# Altium schematic sheet SUPPLY.SchDoc
size A4
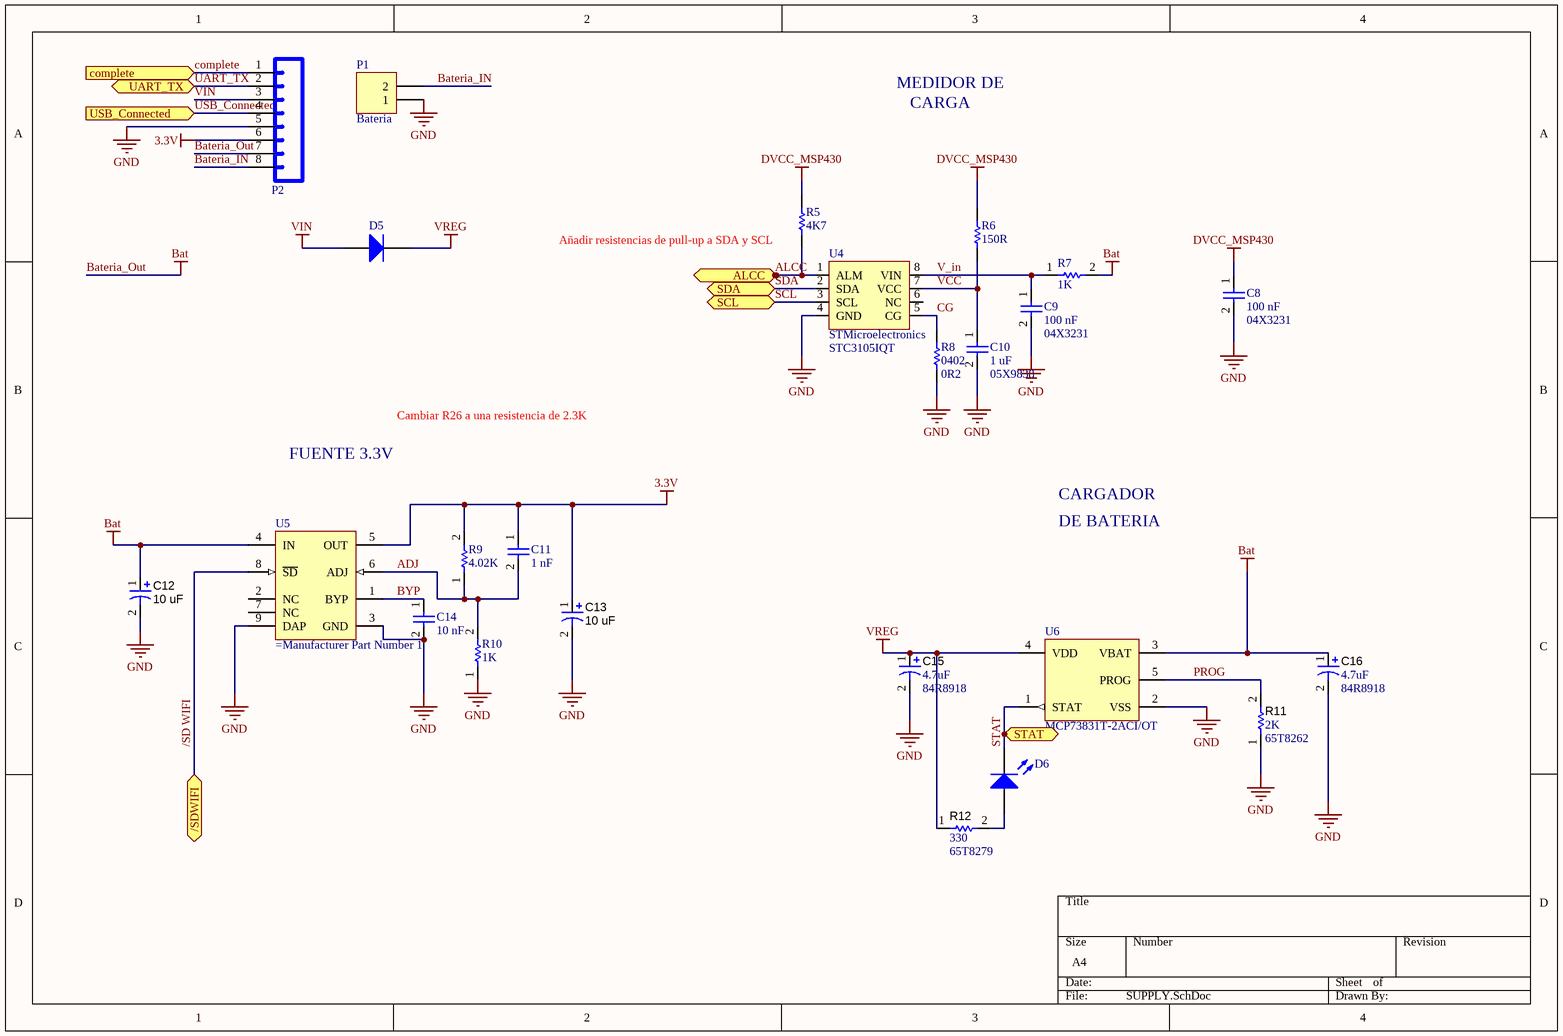
[diagram p0: SUPPLY.SchDoc]

## Parts
C8  100 nF  Supplier Part Number 1: 04X3231  [CR-0402]
C9  100 nF  Supplier Part Number 1: 04X3231  [CR-0402]
C10  1 uF  Supplier Part Number 1: 05X9838  [CR-0402]
C11  1 nF  [CR-0402]
C12  10 uF  [C-0603]
C13  10 uF  [C-0603]
C14  10 nF  [CR-0402]
C15  Supplier Part Number 1: 84R8918  [C-0603]  (hidden comment: 4.7uF)
C16  Supplier Part Number 1: 84R8918  [C-0603]  (hidden comment: 4.7uF)
D5  58K2394  [DO-214AA d]  (value not drawn)
D6  LED0  [CR-0402]  (value not drawn)
P1  Bateria  [HDR1X2]
P2  68000-236HLF  [HEAD8-NOSS]  (value not drawn)
R5  4K7  [CR-0402]
R6  150R  [CR-0402]
R7  1K  [CR-0402]
R8  0402  value 0R2  [R-0402]
R9  4.02K  [CR-0402]
R10  1K  [CR-0402]
R11  Supplier Part Number 1: 65T8262  [CR-0402]  (hidden comment: 2K)
R12  Supplier Part Number 1: 65T8279  [R-0402]  (hidden comment: 330)
U4  STMicroelectronics  Manufacturer Part Number 1: STC3105IQT  [TDFN8]
U5  (no value)  [SO8 DDA]
U6  MCP73831T-2ACI/OT  [SOT-23-5_3d]

## Ports
/SDWIFI (bidir), ALCC (bidir), complete (in), SCL (bidir), SDA (bidir), STAT (out), UART_TX (bidir), USB_Connected (in)

## Nets
3.3V: C11.1 C13.1(+) P2.6 R9.2 U5.5(OUT)
Bateria_Out: C12.1(+) C16.1(+) P2.7 R7.2 U5.4(IN) U6.3(VBAT)  [also labelled Bat]
DVCC_MSP430: C8.1 R5.2 R6.2
GND: C8.2 C9.2 C10.2 C12.2(-) C13.2(-) C14.2 C15.2(-) C16.2(-) P1.1 P2.5 R8.1 R10.1 R11.1 U4.4(GND) U5.3(GND) U5.9(DAP) U6.2(VSS)
VIN: D5.1(A) P2.3
VREG: C15.1(+) D5.2(K) R12.1 U6.4(VDD)
/SD WIFI: U5.8(~{SD}) ; port /SDWIFI
ADJ: C11.2 R9.1 R10.2 U5.6(ADJ)
ALCC: R5.1 U4.1(ALM) ; port ALCC
Bateria_IN: P1.2 P2.8
BYP: C14.1 U5.1(BYP)
CG: R8.2 U4.5(CG)
complete: P2.1 ; port complete
PROG: R11.2 U6.5(PROG)
SCL: U4.3(SCL) ; port SCL
SDA: U4.2(SDA) ; port SDA
STAT: D6.2(K) U6.1(STAT) ; port STAT
UART_TX: P2.2 ; port UART_TX
USB_Connected: P2.4 ; port USB_Connected
V_in: C9.1 R7.1 U4.8(VIN)
VCC: C10.1 R6.1 U4.7(VCC)
NetD6_1: D6.1(A) R12.2

Not connected (* = marked no-connect by the designer): U4 6(NC); U5 2(NC) 7(NC)

## Notes on the sheet
- MEDIDOR DE
- CARGA
- (near R5) Añadir resistencias de pull-up a SDA y SCL
- Cambiar R26 a una resistencia de 2.3K
- FUENTE 3.3V
- CARGADOR
- DE BATERIA

## Library data of the parts
C8 C9 = C1005X7R1H104M050BB: TDK - C1005X7R1H104M050BB - CAP CERAMIC, 0.1UF, 50V, X7R, 0402; Value: 100 nF; Supplier 1: Newark; ComponentLink1URL: http://product.tdk.com/capacitor/mlcc/en/documents/mlcc_commercial_general_en.pdf; ComponentLink1Description: http://product.tdk.com/capacitor/mlcc/en/documents/mlcc_commercial_general_en.pdf; Supplier 2: Mouser; Supplier Part Number 2: 810-C1005X7R1H104M
C10 = C1005X5R1E105K050BC: TDK - C1005X5R1E105K050BC - CAP, MLCC, X5R, 1UF, 25V, 0402; Value: 1 uF; Supplier 1: Newark; ComponentLink1URL: http://www.farnell.com/datasheets/1796654.pdf; ComponentLink1Description: http://www.farnell.com/datasheets/1796654.pdf; Supplier 2: Mouser; Supplier Part Number 2: 810-C1005X5R1E105K
C11 = C1005X7R1E102K050BA: TDK - C1005X7R1E102K050BA - CAPACITOR CERAMIC 1000PF, 25V, X7R, 10%, 0402; Value: 1 nF; ComponentLink1URL: http://www.farnell.com/datasheets/1571323.pdf; ComponentLink1Description: http://www.farnell.com/datasheets/1571323.pdf; ComponentLink2URL: http://www.farnell.com/datasheets/1718611.pdf; ComponentLink2Description: http://www.farnell.com/datasheets/1718611.pdf; Supplier 1: Newark; Supplier Part Number 1: 90R7603; Supplier 2: Mouser; Supplier Part Number 2: 810-C1005X7R1E102K
C12 C13 = F981A106MMA: NICHICON - F981A106MMA - CAPACITOR TANT, 10UF, 10V 20%; Product Range: NICHICON - F98 Series; Capacitance: 10; Capacitor Case Style: 0603 ^1608 Metric]; ESR: 7.5; Value: 10 uF; Capacitance Tolerance: ± 20%; Voltage Rating: 10; Operating Temperature Max: 125; Series: F98; ComponentLink1URL: http://www.nichicon.co.jp/english/products/pdfs/e-f98.pdf; ComponentLink1Description: http://www.nichicon.co.jp/english/products/pdfs/e-f98.pdf; Supplier 1: Newark; Supplier Part Number 1: 70R1053; Supplier 2: Mouser; Supplier Part Number 2: 647-F981A106MMA
C14 = C1005X7R1H103K050BB: TDK - C1005X7R1H103K050BB - CAP CERAMIC, 0.01UF, 50V, X7R, 0402; Product Range: TDK - C Series; Capacitance: 0.01; Capacitance Tolerance: ± 10%; Dielectric Characteristic: X7; Voltage Rating: 50; Capacitor Case Style: 0402 ^1005 Metric]; Value: 10 nF; Packaging: Cut Tape; MSL: -; ComponentLink1URL: http://product.tdk.com/capacitor/mlcc/en/documents/mlcc_commercial_general_en.pdf; ComponentLink1Description: http://product.tdk.com/capacitor/mlcc/en/documents/mlcc_commercial_general_en.pdf; Supplier 1: Newark; Supplier Part Number 1: 04X3229; Supplier 2: Mouser; Supplier Part Number 2: 810-C1005X7R1H103K
C15 C16 = F981C475MMA: CAP, TANTALUM, 4.7UF, 20%, 16V, 20 OHM, SMT0603; PART NUMBER: F980J475MUA; MANUFACTURER: NICHICON; POPULATE: Y; CONSIGNED: N; VALUE: 4.7uF; Supplier 1: Newark; Supplier 2: Mouser; Supplier Part Number 2: 647-F981C475MMA
D5 = Diode: Default Diode; Published: 8-Jun-2000; LatestRevisionDate: 17-Jul-2002; LatestRevisionNote: Re-released for DXP Platform.; PackageVersion: Sep-1996; PackageReference: SMC; Publisher: Altium Limited; PackageDescription: DO-214-AB/SMC; 2 C-Bend Leads; Body 7.9 x 5.9 mm, inc. leads (LxW); Code_JEDEC: DO-214-AB; Supplier 1: Newark; Supplier Part Number 1: 58K2394; Supplier 2: Mouser; Supplier Part Number 2: 512-S2J
D6 = LED0: LED Blue; Published: 8-Jun-2000; LatestRevisionDate: 08-Jul-2005; LatestRevisionNote: Mech Layer 1 removed.; PackageReference: LED-0; Publisher: Altium Limited; PackageDescription: LED; 2 Leads; Supplier 1: Newark; Supplier Part Number 1: 75R0580; Supplier 2: Mouser; Supplier Part Number 2: 645-598-8091-107F
P1 = Header 2: Header, 2-Pin; LatestRevisionDate: 17-Jul-2002; LatestRevisionNote: Re-released for DXP Platform.; Publisher: Altium Limited
P2 = HEADER 1X8: Manufacturer: Amphenol FCI; Current Rating: 3 A; Mounting Angle: Straight; Number of Positions: 36 Position; Voltage Rating: 1.5 kV; Pitch: 2.54 mm; Insulation Resistance: 5 GOhms; Mating Post Length: 5.84 mm; Supplier 1: Mouser; Manufacturer Part Number: 68000-236HLF; RoHS: RoHS Compliant; Category: Headers & Wire Housings; Stock 1: 1164; Pricing 1: 1=1.89, 10=1.65, 100=1.47, 200=1.42, 500=1.23, 1000=1.00 (MXN); Contact Plating: Gold; Housing Material: Thermoplastic (TP); Number of Rows: 1 Row; Packaging: Bulk; Product: Headers; Termination Style: Solder Pin; Type: Pin Strip; Brand: Amphenol FCI; Contact Material: Phosphor Bronze; Flammability Rating: UL 94 V-0; Mounting Style: -; Contact Gender: Pin (Male); Housing Color: Black; Housing Gender: -; Maximum Operating Temperature: + 125 C; Minimum Operating Temperature: - 65 C; Product Type: Headers & Wire Housings; Standard Pack Qty: 100; Subcategory: Headers & Wire Housings; Termination Post Length: 2.41 mm; Tradename: BergStik; RoHS - Mouser: Y; Minimum Order Quantity: 1; Reeling: False; ComponentLink1URL: https://www.mouser.com/datasheet/2/18/68000-1266375.pdf; ComponentLink1Description: https://www.mouser.com/datasheet/2/18/68000-1266375.pdf; Supplier Part Number 1: 649-68000-236HLF
R5 = CRCW02014K70FNED: VISHAY DALE - CRCW02014K70FNED - THICK FILM RESISTOR, 4.7 KOHM, 50 mW, 1%, FULL REEL; Product Range: AEC-Q200 CRCW Series; Resistance: 4.7; Power Rating: 50; Resistor Case Style: 0201 [0603 Metric]; Resistance Tolerance: 1%; Resistor Element Type: Thick Film; ComponentLink1URL: http://www.farnell.com/datasheets/1719906.pdf; ComponentLink1Description: http://www.farnell.com/datasheets/1719906.pdf; Value: 4K7; Supplier 1: Newark; Supplier Part Number 1: 52K7045
R6 = CRCW0201150RFNED: VISHAY DALE - CRCW0201150RFNED - THICK FILM RESISTOR, 150 OHM, 50 mW, 1%, FULL REEL; Product Range: AEC-Q200 CRCW Series; Resistance: 150; Power Rating: 50; Resistor Case Style: 0201 [0603 Metric]; Resistance Tolerance: 1%; Resistor Element Type: Thick Film; MSL: -; ComponentLink1URL: http://www.farnell.com/datasheets/1719906.pdf; ComponentLink1Description: http://www.farnell.com/datasheets/1719906.pdf; Value: 150R; Supplier 1: Newark; Supplier Part Number 1: 52K6721
R7 R10 = CRCW02011K00FNED: VISHAY DALE - CRCW02011K00FNED - RESISTOR, THICK FILM CHIP, 1KOHM 50mW, 1%, FULL REEL; Value: 1K; ComponentLink1URL: http://www.vishay.com/docs/20035/dcrcwe3.pdf; ComponentLink1Description: http://www.vishay.com/docs/20035/dcrcwe3.pdf; Supplier 1: Newark; Supplier Part Number 1: 52K6545; Supplier 2: Mouser; Supplier Part Number 2: 71-CRCW02011K00FNED
R8 = ERJ-2BSFR20X: PANASONIC ELECTRONIC COMPONENTS - ERJ-2BSFR20X - RESISTOR, 0.2OHM, 166mW, 1%, SMD; Supplier 1: Newark; Stock 1: 1838; Pricing 1: 1=0.802, 50=0.332, 100=0.275, 250=0.218, 500=0.185, 1000=0.138, 2500=0.103 (USD); ComponentLink1URL: http://www.farnell.com/cad/1697901.zip; ComponentLink1Description: http://www.farnell.com/cad/1697901.zip; ComponentLink2URL: http://www.farnell.com/datasheets/1790602.pdf; ComponentLink2Description: http://www.farnell.com/datasheets/1790602.pdf; Supplier Part Number 1: 53W4138; Manufacturer 1: PANASONIC ELECTRONIC COMPONENTS; Manufacturer Part Number 1: ERJ-2BSFR20X; RoHS 1: YES; Description 1: PANASONIC ELECTRONIC COMPONENTS - ERJ-2BSFR20X - RESISTOR, 0.2OHM, 166mW, 1%, SMD; Supplier 2: Mouser; Supplier Part Number 2: 667-ERJ-2BSFR20X
R9 = CRCW02014K02FNED: VISHAY DALE - CRCW02014K02FNED - RESISTOR, THICK FILM, 4.02 KOHM, 50 mW, 1%, FULL REEL; Product Range: VISHAY - CRCW Series; Resistance: 4.02; Power Rating: 50; Resistor Case Style: 0201 ^0603 Metric]; Value: 4.02K; Supplier 1: Farnell; Stock 1: 9995; Pricing 1: 10000=0.007, 20000=0.007, 30000=0.007, 50000=0.006 (GBP); Resistance Tolerance: ± 1%; Resistor Element Type: Thick Film; ComponentLink1URL: http://www.farnell.com/datasheets/1700795.pdf; ComponentLink1Description: http://www.farnell.com/datasheets/1700795.pdf; Supplier Part Number 1: 2322928; Manufacturer 1: VISHAY DALE; Manufacturer Part Number 1: CRCW02014K02FNED; RoHS 1: YES; Description 1: VISHAY DALE - CRCW02014K02FNED - RESISTOR, THICK FILM, 4.02 KOHM, 50 mW, 1%, FULL REEL
R11 = ERJ-2GEJ202X: RESISTOR, THICK FILM, 2K, 5%, 0.1W, SMT0402; PARTNUMBER: PANASONIC; POPULATE: Y; CONSIGNED: N; PART NUMBER: ERJ-2GEJ202X; Supplier 1: Newark; VALUE: 2K; Supplier 2: Mouser; Supplier Part Number 2: 667-ERJ-2GEJ202X
R12 = ERJ-2GEJ331X: RESISTOR, THICK FILM, 330, 5%, 0.1W, SMT0402; MANUFACTURER: PANASONIC; POPULATE: Y; CONSIGNED: N; PART NUMBER: ERJ-2GEJ331X; Supplier 1: Newark; VALUE: 330; Supplier 2: Mouser; Supplier Part Number 2: 667-ERJ-2GEJ331X
U4 = STC3105: IC BATTERY MON GAS GAUGE 8-TDFN; Function: Fuel, Gas Gauge/Monitor; Voltage - Supply: 2.7 V ~ 5.5 V; Value: STC3105IQT; Supplier 1: Digi-Key; Category: Integrated Circuits (ICs); Stock 1: 49; Pricing 1: 1=1.9, 10=1.714, 25=1.5352, 100=1.3804, 250=1.22572, 500=1.071, 1000=0.88655 (USD); Packaging: Cut Tape (CT); Battery Chemistry: -; Operating Temperature: -40°C ~ 85°C; Mounting Type: Surface Mount; Package / Case: 8-WDFN; Supplier Device Package: 8-TDFN (3x2); ComponentLink1URL: http://www.st.com/web/en/resource/technical/document/datasheet/DM00037883.pdf; ComponentLink1Description: http://www.st.com/web/en/resource/technical/document/datasheet/DM00037883.pdf; Supplier Part Number 1: 497-12092-1-ND; Manufacturer 1: STMicroelectronics; RoHS 1: RoHS Compliant; Description 1: IC BATTERY MON GAS GAUGE 8-TDFN; Supplier 2: Mouser; Supplier Part Number 2: 511-STC3105IQT
U5 = LP3878MRX-ADJ/NOPB: TEXAS INSTRUMENTS - LP3878MRX-ADJ/NOPB - IC, LDO REGULATOR, 800mA, 1-5.5V, FULL REEL; Input Voltage Min: 2.5; Input Voltage Max: 16; Output Voltage Min: 1; Output Voltage Max: 5.5; Output Current: 800; Dropout Voltage Vdo: 475; No. of Pins: 8; Packaging: Tape & Reel; ComponentLink1URL: http://cache.national.com/ds/LP/LP3878-ADJ.pdf; ComponentLink1Description: http://cache.national.com/ds/LP/LP3878-ADJ.pdf; Supplier 1: Newark; Supplier Part Number 1: 65K6513; Supplier 2: Mouser; Supplier Part Number 2: 926-LP3878MRXADJNOPB
U6 = MCP73831T-2ACI/OT: Miniature Single-Cell, Fully Integrated Li-Ion, Li-Polymer Charge Management Controller, 4.2V, 5-Pin SOT-23, Industrial Temperature, Tape and Reel; Published: 29-Jan-2009; LatestRevisionDate: 27-Nov-2009; LatestRevisionNote: Updated to datasheet revision E, Sep-2008; DatasheetVersion: revE, Sep-2008; PackageVersion: revBB, Aug-2009; PackageReference: SOT-23-OT5; Publisher: Altium Limited; PackageDescription: 5-Lead Plastic Small Outline Transistor (OT) [SOT-23]; Supplier 1: Digi-Key; Supplier Part Number 1: MCP73831T-2ACI/OTCT-ND; Supplier 2: Farnell; Supplier Part Number 2: 1332158; Code_IPC: SOT23-5; ComponentLink1Description: Datasheet; ComponentLink1URL: http://ww1.microchip.com/downloads/en/DeviceDoc/21984e.pdf; ComponentLink2Description: Packaging Specification; ComponentLink2URL: http://www.microchip.com/stellent/groups/techpub_sg/documents/packagingspec/en012702.pdf; ComponentLink3Description: Microchip.com Home; ComponentLink3URL: http://www.microchip.com/; Supplier 3: Mouser; Supplier Part Number 3: 579-MCP73831T-2ACIOT